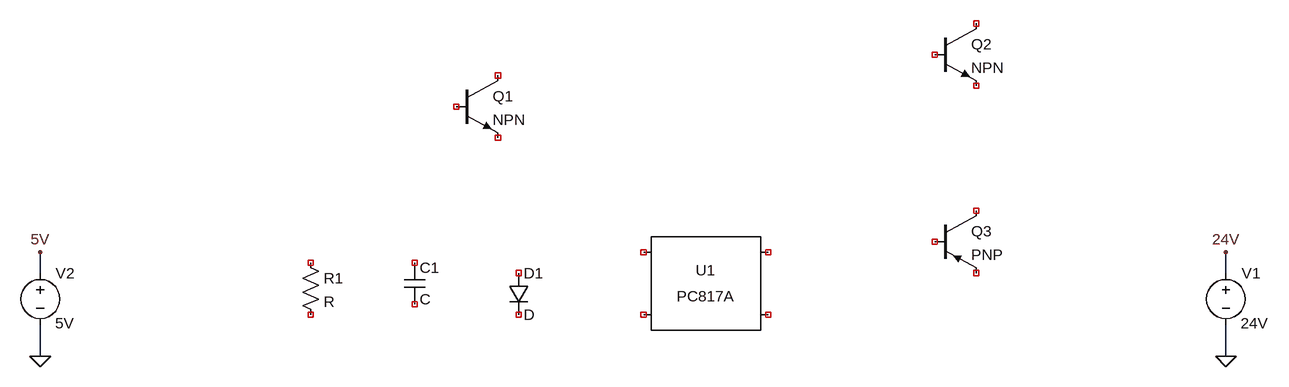
[diagram p0: schematic OptoOutput_5V-24V_15mA.asc]
OptoOutput_5V-24V_15mA.asc, the LTspice schematic file:
Version 4
SHEET 1 1248 680
WIRE -1264 -256 -1264 -288
WIRE 560 -256 560 -288
WIRE -1264 -128 -1264 -176
WIRE 560 -128 560 -176
FLAG 560 -128 0
FLAG 560 -288 24V
FLAG -1264 -128 0
FLAG -1264 -288 5V
SYMBOL res -864 -288 R0
SYMATTR InstName R1
SYMBOL cap -704 -272 R0
SYMATTR InstName C1
SYMBOL diode -544 -256 R0
SYMATTR InstName D1
SYMBOL Optos\\PC817A -240 -240 R0
SYMATTR InstName U1
SYMBOL voltage 560 -272 R0
WINDOW 3 23 93 Left 2
WINDOW 123 0 0 Left 2
WINDOW 39 -29 126 VLeft 2
SYMATTR Value 24V
SYMATTR InstName V1
SYMBOL voltage -1264 -272 R0
WINDOW 3 23 93 Left 2
WINDOW 123 0 0 Left 2
WINDOW 39 -29 126 VLeft 2
SYMATTR Value 5V
SYMATTR InstName V2
SYMBOL npn -624 -560 R0
SYMATTR InstName Q1
SYMBOL npn 112 -640 R0
SYMATTR InstName Q2
SYMBOL pnp 112 -352 R0
SYMATTR InstName Q3

The netlist it stands for:
* OptoOutput_5V-24V_15mA.asc
R1 NC_01 NC_02 R
C1 NC_03 NC_04 C
D1 NC_05 NC_06 D
XU1 NC_07 NC_08 NC_09 NC_10 PC817 Igain=1m
V1 24V 0 24V
V2 5V 0 5V
Q1 NC_11 NC_12 NC_13 0 NPN
Q2 NC_14 NC_15 NC_16 0 NPN
Q3 NC_17 NC_18 NC_19 0 PNP
.model D D
.lib standard.dio
.model NPN NPN
.model PNP PNP
.lib standard.bjt
.lib PC817.sub
.backanno
.end